# Altium schematic sheet Copy of 2019-07-31_19-54-381.schdoc
size 226 x 140 mm; SheetNumber: 1; SheetTotal: 1
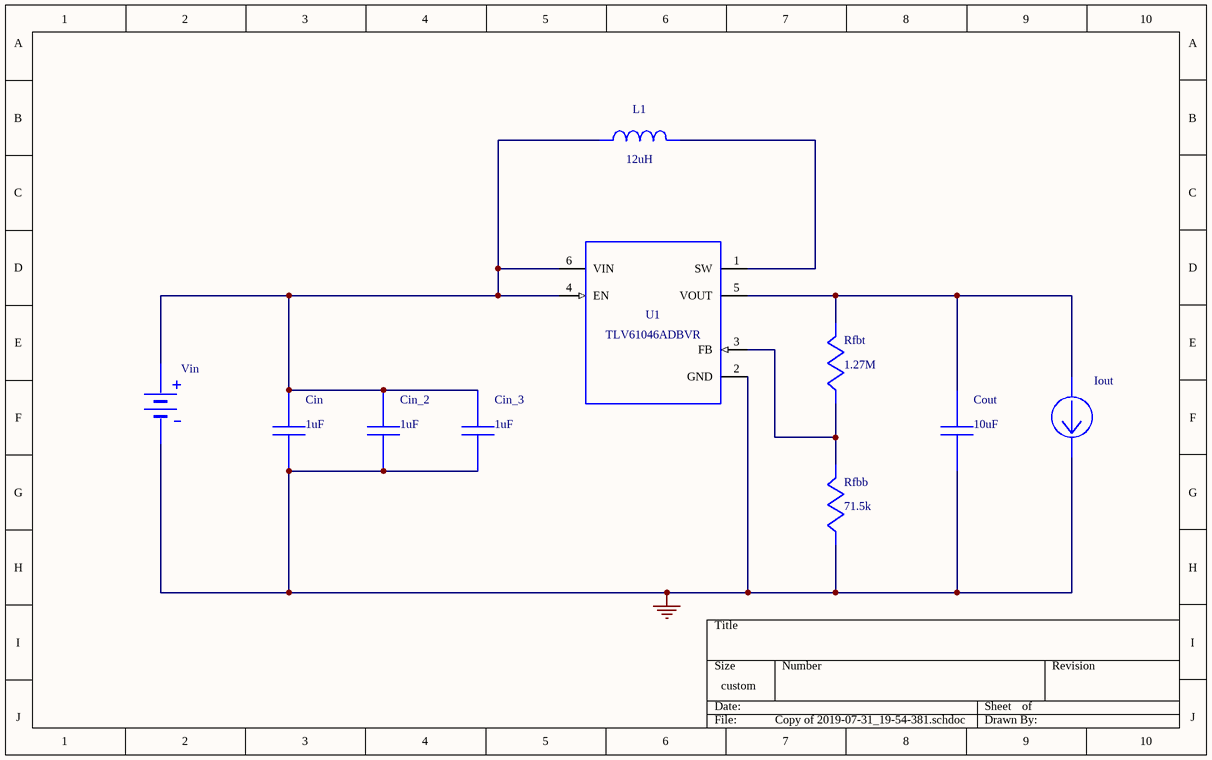
[diagram p0: Copy of 2019-07-31_19-54-381.schdoc]

## Parts
Cin  value 1uF  (hidden comment: C0603C105K8PACTU)
Cin_2  value 1uF  (hidden comment: C0603C105K8PACTU)
Cin_3  value 1uF  (hidden comment: C0603C105K8PACTU)
Cout  value 10uF  (hidden comment: CL32B106KBJNNWE)
Iout  WB_CURRENT_LOAD  (value not drawn)
L1  value 12uH  (hidden comment: NPI43C120MTRF)
Rfbb  value 71.5k  (hidden comment: CRCW040271K5FKED)
Rfbt  value 1.27M  (hidden comment: CRCW04021M27FKED)
U1  TLV61046ADBVR
Vin  WB_BATTERY  (value not drawn)

## Nets
0: Cin.2 Cin_2.2 Cin_3.2 Cout.2 Iout.2(-) Rfbb.2 U1.2(GND) Vin.2(-)
NetCin_1: Cin.1 Cin_2.1 Cin_3.1 L1.1 U1.4(EN) U1.6(VIN) Vin.1(+)
NetCout_1: Cout.1 Iout.1(+) Rfbt.1 U1.5(VOUT)
NetL1_2: L1.2 U1.1(SW)
NetRfbb_1: Rfbb.1 Rfbt.2 U1.3(FB)

## Library data of the parts
Cin Cin_2 Cin_3 = C0603C105K8PACTU: Manufacturer Name: Kemet; PackageReference: C0603C105K8PACTU; Manufacturer Part Number: C0603C105K8PACTU
Cout = CL32B106KBJNNWE: Manufacturer Name: Samsung Electro-Mechanics; PackageReference: CL32B106KBJNNWE; Manufacturer Part Number: CL32B106KBJNNWE
L1 = NPI43C120MTRF: Manufacturer Name: NIC Components; PackageReference: NPI43C120MTRF; Manufacturer Part Number: NPI43C120MTRF
Rfbb = CRCW040271K5FKED: Manufacturer Name: Vishay-Dale; PackageReference: CRCW040271K5FKED; Manufacturer Part Number: CRCW040271K5FKED
Rfbt = CRCW04021M27FKED: Manufacturer Name: Vishay-Dale; PackageReference: CRCW04021M27FKED; Manufacturer Part Number: CRCW04021M27FKED
U1 = TLV61046ADBVR: Manufacturer Name: Texas Instruments; PackageReference: TLV61046ADBVR; Manufacturer Part Number: TLV61046ADBVR; Value: N/A
Iout = WB_CURRENT_LOAD: PackageReference: WB_CURRENT_LOAD; Manufacturer Part Number: WB_CURRENT_LOAD; Manufacturer Name: WB_CURRENT_LOAD; Value: N/A
Vin = WB_BATTERY: PackageReference: WB_BATTERY; Manufacturer Part Number: WB_BATTERY; Manufacturer Name: WB_BATTERY; Value: N/A